# EAGLE design SY88022AL_V2 (EAGLE 9.2.2)
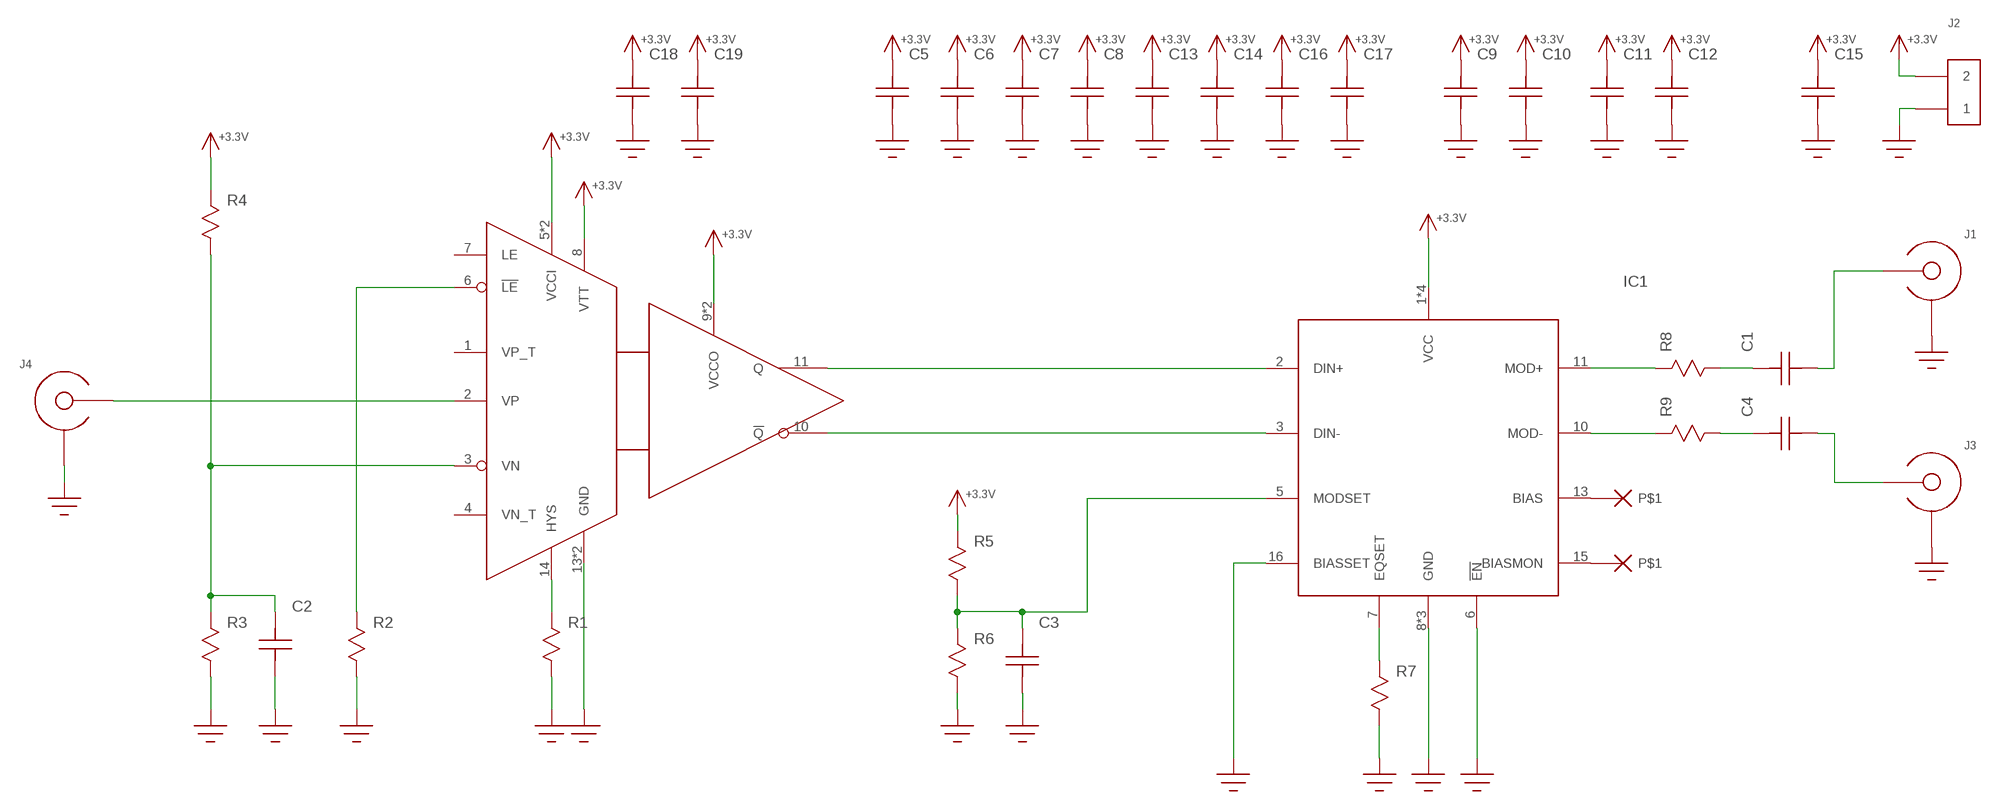
[diagram p0: schematic, sheet 1]

## Parts
C1  C  [C0402]
C2  C0603  [C0603]
C3  C0603  [C0603]
C4  C  [C0402]
C5  C  [C0402]
C6  C  [C0402]
C7  C  [C0402]
C8  C  [C0402]
C9  C0603  [C0603]
C10  C0603  [C0603]
C11  C0603  [C0603]
C12  C0603  [C0603]
C13  C  [C0402]
C14  C  [C0402]
C15  C1206  [1206]
C16  C  [C0402]
C17  C  [C0402]
C18  C0201  [0201]
C19  C0201  [0201]
IC1  SY88022AL  [TQFN16-EP]
J1  SMA_END_LAUNCH4L  [SMA_EDGE_LAUNCH]
J2  HEADER_2PIN  [HEADER_2PIN]
J3  SMA_END_LAUNCH4L  [SMA_EDGE_LAUNCH]
J4  SMA_END_LAUNCH4L  [SMA_EDGE_LAUNCH]
R1  R0603  [R0603]
R2  R0603  [R0603]
R3  R0603  [R0603]
R4  R0603  [R0603]
R5  R0603  [R0603]
R6  R0603  [R0603]
R7  R0603  [R0603]
R8  R0402  [0402]
R9  R0402  [0402]
U$1  ADCMP572  [TQFN16-EP]
U$20  NO_CONNECT  (no package)
U$21  NO_CONNECT  (no package)

## Nets
+3.3V: C5.2 C6.2 C7.2 C8.2 C9.P$2 C10.P$2 C11.P$2 C12.P$2 C13.2 C14.2 C15.P$2 C16.2 C17.2 C18.P$2 C19.P$2 IC1.1(VCC) IC1.4(VCC) IC1.9(VCC) IC1.12(VCC) J2.2 R4.P$1 R5.P$1 U$1.5(VCCI) U$1.8(VTT) U$1.9(VCCO) U$1.12(VCCO) U$1.16(VCCI)
GND: C2.P$1 C3.P$1 C5.1 C6.1 C7.1 C8.1 C9.P$1 C10.P$1 C11.P$1 C12.P$1 C13.1 C14.1 C15.P$1 C16.1 C17.1 C18.P$1 C19.P$1 IC1.6(!EN!) IC1.8(GND) IC1.14(GND) IC1.16(BIASSET) IC1.EP(GND) J1.BOTTOM_PAD(SHIELD) J1.GND@1(SHIELD) J1.GND@2(SHIELD) J1.GND@3(SHIELD) J1.GND@4(SHIELD) J1.GND@5(SHIELD) J1.GND@6(SHIELD) J1.GND@7(SHIELD) J1.GND@8(SHIELD) J1.GND@14(SHIELD) J1.GND@15(SHIELD) J1.GND@16(SHIELD) J1.GND@17(SHIELD) J1.GND_PAD1(SHIELD) J1.GND_PAD2(SHIELD) J2.1 J3.BOTTOM_PAD(SHIELD) J3.GND@1(SHIELD) J3.GND@2(SHIELD) J3.GND@3(SHIELD) J3.GND@4(SHIELD) J3.GND@5(SHIELD) J3.GND@6(SHIELD) J3.GND@7(SHIELD) J3.GND@8(SHIELD) J3.GND@14(SHIELD) J3.GND@15(SHIELD) J3.GND@16(SHIELD) J3.GND@17(SHIELD) J3.GND_PAD1(SHIELD) J3.GND_PAD2(SHIELD) J4.BOTTOM_PAD(SHIELD) J4.GND@1(SHIELD) J4.GND@2(SHIELD) J4.GND@3(SHIELD) J4.GND@4(SHIELD) J4.GND@5(SHIELD) J4.GND@6(SHIELD) J4.GND@7(SHIELD) J4.GND@8(SHIELD) J4.GND@14(SHIELD) J4.GND@15(SHIELD) J4.GND@16(SHIELD) J4.GND@17(SHIELD) J4.GND_PAD1(SHIELD) J4.GND_PAD2(SHIELD) R1.P$2 R2.P$2 R3.P$2 R6.P$2 R7.P$2 U$1.13(GND) U$1.15(GND)
N$1: IC1.2(DIN+) U$1.11(Q)
N$2: IC1.3(DIN-) U$1.10(!Q!)
N$3: R1.P$1 U$1.14(HYS)
N$4: R2.P$1 U$1.6(!LE!)
N$5: C2.P$2 R3.P$1 R4.P$2 U$1.3(VN)
N$6: J4.CENTER@1(CENTER) J4.CENTER@2(CENTER) U$1.2(VP)
N$7: C3.P$2 IC1.5(MODSET) R5.P$2 R6.P$1
N$8: C1.2 R8.2
N$9: IC1.7(EQSET) R7.P$1
N$10: IC1.15(BIASMON) U$20.P$1
N$11: IC1.13(BIAS) U$21.P$1
N$12: IC1.11(MOD+) R8.1
N$13: IC1.10(MOD-) R9.1
N$14: C4.2 R9.2
N$15: C1.1 J1.CENTER@1(CENTER) J1.CENTER@2(CENTER)
N$16: C4.1 J3.CENTER@1(CENTER) J3.CENTER@2(CENTER)
Unconnected: U$1.1(VP_T) U$1.4(VN_T) U$1.7(LE)

## Library data of the parts
C1-C19 = yapo:C
IC1 = yapo:SY88022AL
J1 J3 J4 = yapo:SMA_END_LAUNCH
J2 = yapo:HEADER_2PIN
R1-R9 = yapo:R
U$1 = yapo:ADCMP572
U$20 U$21 = yapo:NO_CONNECT

## Board
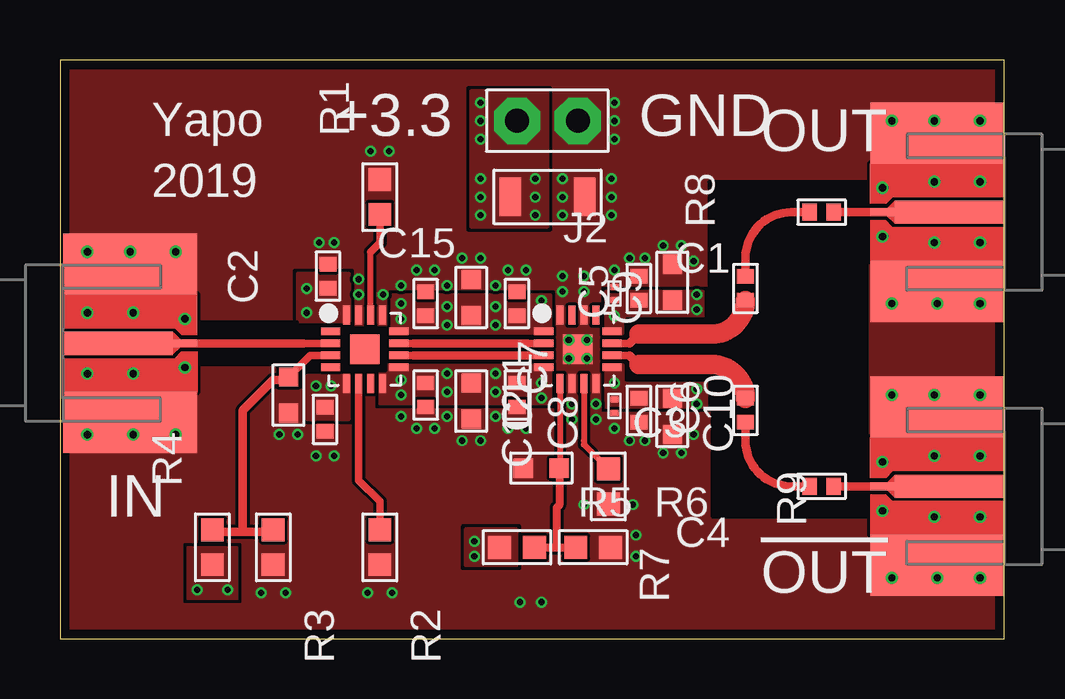
[diagram p1: board, top side]
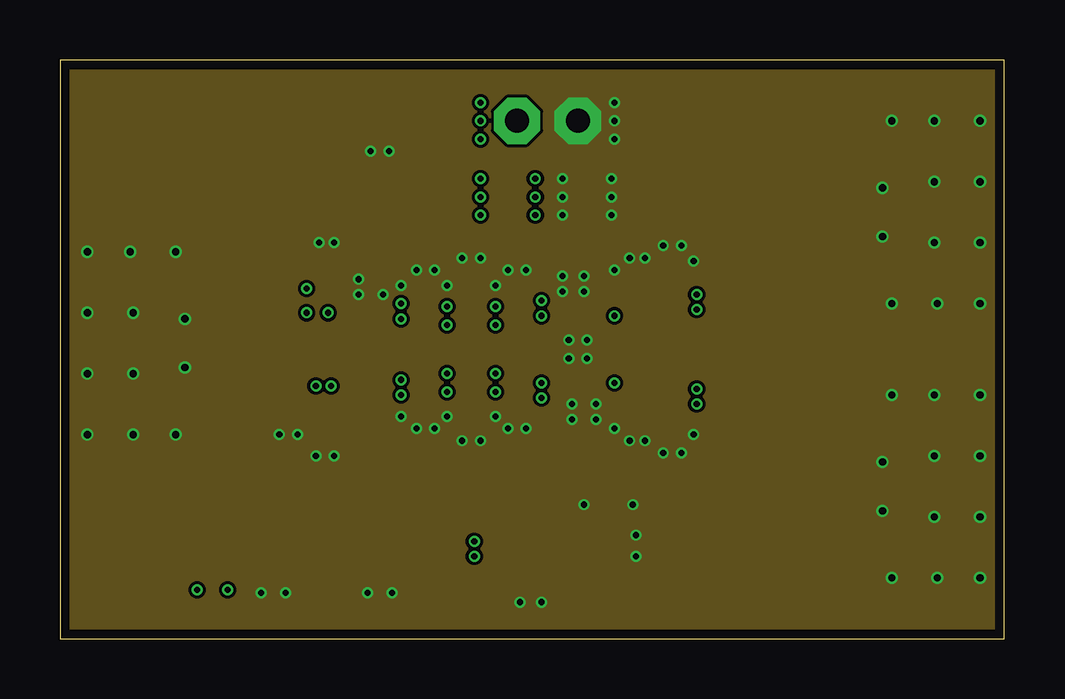
[diagram p2: board, inner layer Route2]
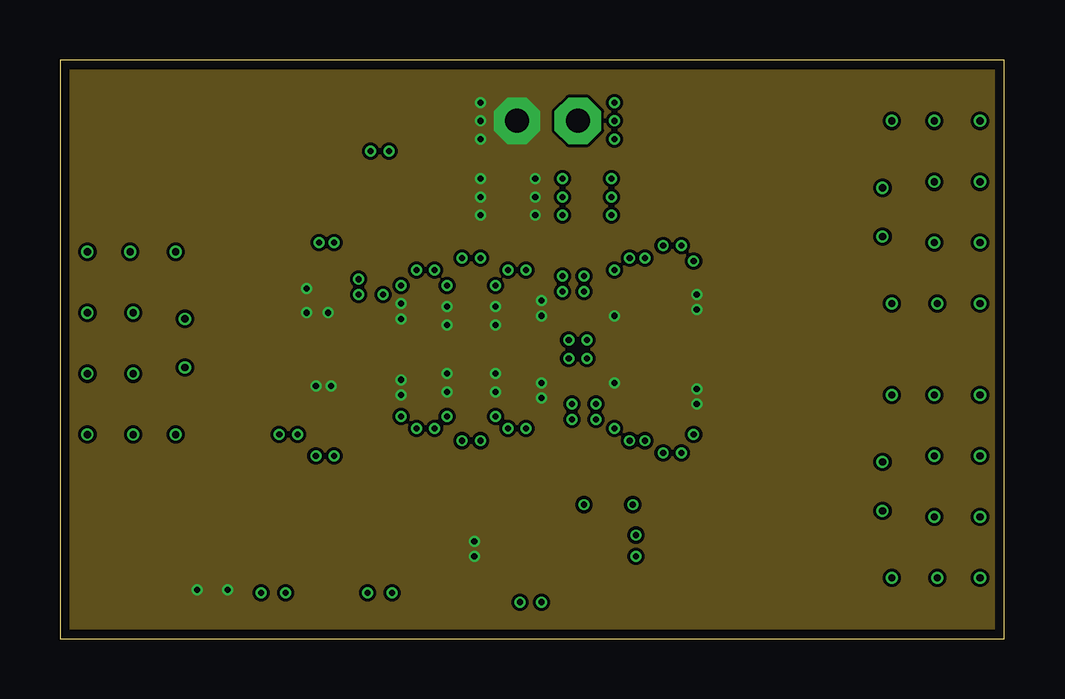
[diagram p3: board, inner layer Route15]
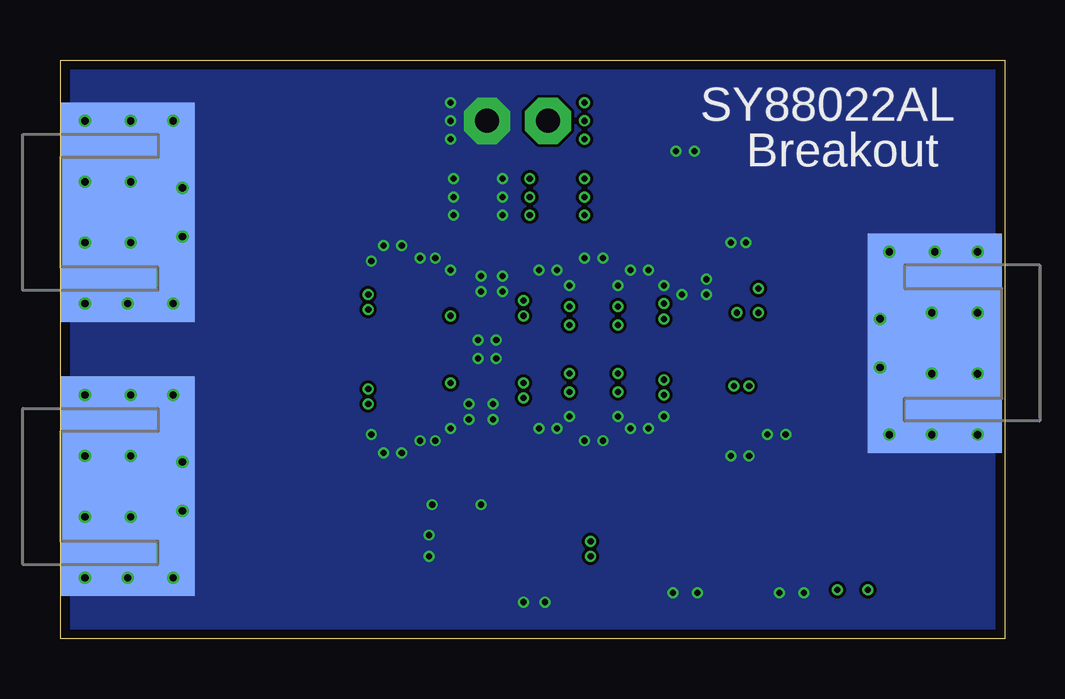
[diagram p4: board, bottom side, seen from below]

Size 39.37 x 24.13 mm. Coordinates in mm from the lower left corner, seen from the top.
Outline: 0,0 39.37,0 39.37,24.13 0,24.13 0,0
Copper layers (1*2*15*16): Top 0.035559375mm / dielectric 0.17018125mm / Route2 0.01778125mm / dielectric 47mil / Route15 0.01778125mm / dielectric 0.17018125mm / Bottom 0.035559375mm
Design rules "oshpark-4layer *": minimum track width 5mil, minimum drill 10mil, track to track 5mil, track to pad 5mil, pad to pad 5mil, via to via 5mil, smd to smd 5mil, copper to edge 15mil, drill to drill 6mil, minimum pad ring 4mil, minimum via ring 4mil, stop-mask expansion 2.5mil, vias tented up to drill 20mil, thermal gap 10mil
tRestrict: area 11.8,11.2 to 13.6,13

### Footprints (pad centres in the part's own frame; a part is rotated, then mirrored left to right if it is on the bottom)
C0402 = smd 0.6 x 0.7: 1 -0.5,0; 2 0.5,0
C0603 = smd 0.8 x 0.8: P$1 -0.75,0; P$2 0.75,0
1206 = smd 0.9 x 1.6: P$1 -1.55,0; P$2 1.55,0
0201 = smd 0.35 x 0.25: P$1 0,0.275; P$2 0,-0.275
TQFN16-EP = smd 0.3 x 0.8: 1 -0.75,-1.425; 2 -0.25,-1.425; 3 0.25,-1.425; 4 0.75,-1.425; 9 0.75,1.425; 10 0.25,1.425; 11 -0.25,1.425; 12 -0.75,1.425 | smd 0.8 x 0.3: 5 1.425,-0.75; 6 1.425,-0.25; 7 1.425,0.25; 8 1.425,0.75; 13 -1.425,0.75; 14 -1.425,0.25; 15 -1.425,-0.25; 16 -1.425,-0.75 | smd 1.23 x 1.23: EP 0,0
SMA_EDGE_LAUNCH = smd 5.588 x 9.144 bottom: BOTTOM_PAD 2.794,0 | smd 4.572 x 0.965: CENTER@1 2.286,0 | smd 1.016 x 0.33: CENTER@2 5.08,0 | drill 0.3: GND@1 1.016,3.81; GND@2 4.699,3.81; GND@3 1.016,1.27; GND@4 5.08,1.016; GND@5 1.016,-1.27; GND@6 5.08,-1.016; GND@7 1.016,-3.81; GND@8 4.699,-3.81; GND@14 2.794,3.81; GND@15 2.921,-3.81; GND@16 2.921,-1.27; GND@17 2.921,1.27 | smd 5.588 x 2.54: GND_PAD1 2.794,3.302; GND_PAD2 2.794,-3.302
HEADER_2PIN = drill 1 pad 1.93 octagon: 1 -1.27,0; 2 1.27,0
R0603 = smd 0.95 x 0.95: P$1 -0.725,0; P$2 0.725,0
0402 = smd 0.6 x 0.7: 1 -0.5,0; 2 0.5,0

### Placement (x,y rotation side)
C1  31.75,17.78 180 top
C2  9.53,10.16 90 top
C3  20.07,7.11 0 top
C4  31.75,6.35 180 top
C5  24.13,9.53 90 top
C6  24.13,14.61 270 top
C7  19.05,10.16 90 top
C8  19.05,13.97 270 top
C9  25.53,9.27 90 top
C10  25.53,14.86 270 top
C11  17.14,9.91 90 top
C12  17.14,14.22 270 top
C13  15.24,13.97 270 top
C14  15.24,10.16 90 top
C15  20.32,18.41 180 top
C16  11.05,9.14 90 top
C17  11.18,15.11 270 top
C18  23.11,14.39 0 top
C19  23.11,9.69 180 top
IC1  21.59,12.06 270 top
J1  39.37,17.78 180 top
J2  20.32,21.59 180 top
J3  39.37,6.35 180 top
J4  0.13,12.32 0 top
R1  13.34,18.41 90 top
R2  13.34,3.81 270 top
R3  8.89,3.81 270 top
R4  6.35,3.81 90 top
R5  19.05,3.81 0 top
R6  22.23,3.81 0 top
R7  22.86,6.35 270 top
R8  28.57,14.61 90 top
R9  28.57,9.53 270 top
U$1  12.7,12.06 270 top

### Tracks (layer width: path | path; a pad name or v marks a point on that pad's centre or on a via)
+3.3V  (via drill 0.25)
  other vias: 23.11,13.46 23.11,10.67 26.54,9.78 26.54,10.41 26.54,14.35 26.54,13.72 20.07,13.46 20.07,14.1 16.13,13.84 16.13,13.08 16.13,11.05 20.07,10.67 20.07,10.03 16.13,10.29 14.22,13.34 14.22,10.79 14.22,13.97 14.22,10.16 18.16,13.84 18.16,13.08 18.16,11.05 18.16,10.29 17.53,19.18 17.53,18.41 17.53,17.65 17.53,22.35 17.53,21.59 17.53,20.83 19.81,19.18 19.81,18.41 19.81,17.65 11.18,13.59 10.29,14.61 10.29,13.59 5.71,2.03 6.99,2.03 10.67,10.54 11.3,10.54 17.27,4.06 17.27,3.43
  pour Top (no thermals): 22.73,14.48 22.73,12.73 23.47,12.73 23.47,13.4 26.82,13.4 26.82,14.48
  pour Top (no thermals): 22.73,11.4 22.73,9.65 26.97,9.65 26.97,10.67 23.5,10.67 23.5,11.4
  pour Top (no thermals): 20.45,12.73 13.84,12.73 13.84,14.35 20.45,14.35
  pour Top (no thermals): 20.45,9.78 13.34,9.78 13.34,11.4 20.45,11.4
  pour Route15 (no thermals): 0,0 39.37,0 39.37,24.13 0,24.13
  pour Top (no thermals): 20.32,22.86 20.32,17.14 17.14,17.14 17.14,22.86
  pour Top (no thermals): 9.91,15.24 12.06,15.24 12.06,13.21 9.91,13.21
  pour Top (no thermals): 5.33,3.81 7.37,3.81 7.37,1.65 5.33,1.65
  pour Top (no thermals): 10.29,9.14 12.06,9.14 12.06,10.97 10.29,10.97
  pour Top (no thermals): 16.89,4.57 16.89,3.05 19.05,3.05 19.05,4.57
GND  (via drill 0.25)
  other vias: 10.79,16.51 11.43,16.51 9.14,8.51 9.91,8.51 10.67,7.62 11.43,7.62 8.38,1.91 9.4,1.91 12.83,1.91 13.84,1.91 19.18,1.52 20.07,1.52 24,4.32 24,3.43 23.88,5.59 21.84,5.59 25.15,7.75 25.91,7.75 23.75,8.26 17.53,8.26 18.16,9.27 16.76,8.26 14.22,9.27 16.13,9.27 19.43,8.76 16.76,15.88 17.53,15.88 18.67,15.37 19.43,15.37 14.22,14.73 14.86,15.37 21.84,14.48 23.11,15.37 23.75,15.88 25.15,16.38 25.91,16.38 26.42,15.75 26.42,8.51 23.11,8.76 18.67,8.76 14.86,8.76 15.62,8.76 15.62,15.37 16.13,14.73 18.16,14.73 22.35,9.78 21.34,9.78 21.34,9.14 22.35,9.14 21.21,12.45 21.97,12.45 21.21,11.68 21.97,11.68 24.38,15.88 24.38,8.26 22.99,19.18 22.99,18.41 22.99,17.65 23.11,22.35 23.11,21.59 23.11,20.83 20.95,19.18 20.95,18.41 20.95,17.65 13.46,14.35 12.45,14.35 20.95,14.48 20.95,15.11 21.84,15.11 12.45,14.99 12.95,20.32 13.72,20.32
  pour Top (rank 2, no thermals): 0,0 39.37,0 39.37,24.13 0,24.13
  pour Route2 (no thermals): 0,0 39.37,0 39.37,24.13 0,24.13
  pour Bottom (no thermals): 0,0 39.37,0 39.37,24.13 0,24.13
  cutout Top: 5.71,13.21 5.71,11.43 9.91,11.43 9.91,13.21
  cutout Top: 33.66,19.05 27.05,19.05 27.05,13.34 23.62,13.34 23.62,10.79 27.18,10.79 27.18,5.08 33.66,5.08
N$1
  Top 0.305: U$1.11 14.73,12.31 | IC1.2 19.49,12.31
  Top 0.356: 14.73,12.31 19.49,12.31
N$2
  Top 0.305: U$1.10 14.73,11.81 | 19.49,11.81 IC1.3
  Top 0.356: 14.73,11.81 19.49,11.81
N$3
  Top 0.254: U$1.14 12.95,16.12
  Top 0.305: 12.95,16.12 13.34,16.51 R1.P$1
N$4
  Top 0.305: U$1.6 12.45,6.6 13.34,5.71 R2.P$1
N$5
  Top 0.305: U$1.3 10.43,11.81 C2.P$2
  Top 0.356: C2.P$2 9.41,10.79 8.89,10.79 7.62,9.53 7.62,4.45 | 7.62,4.45 8.8,4.45 R3.P$1 | 7.62,4.45 6.44,4.45 R4.P$2
N$6
  Top 0.305: U$1.2 10.16,12.31
  Top 0.33: J4.CENTER@2 3.17,12.31 J4.CENTER@1
  Top 0.356: 10.16,12.31 3.17,12.31 2.88,12.31
N$7
  Top 0.254: IC1.5 20.84,7.14 C3.P$2
  Top 0.33: R5.P$2 20.7,3.81 | 20.7,3.81 R6.P$1 | C3.P$2 20.82,5.58 20.7,5.46 20.7,3.81
N$8
  Top 0.356: C1.2 30.48,17.78 arc90 28.57,15.88 R8.2
N$9
  Top 0.254: IC1.7 21.84,8.26 21.84,8.1 R7.P$1
N$12
  Top 0.305: IC1.11 23.75,12.31
  Top 0.356: 23.75,12.31 24.13,12.7
  Top 0.813: 24.13,12.7 27.17,12.7 arc90 R8.1
N$13
  Top 0.305: IC1.10 23.75,11.81
  Top 0.356: 23.75,11.81 24.13,11.43
  Top 0.813: 24.13,11.43 27.17,11.43 arc-90 R9.1
N$14
  Top 0.356: C4.2 30.48,6.35 arc-90 28.57,8.26 R9.2
N$15
  Top 0.33: J1.CENTER@1 J1.CENTER@2
  Top 0.356: J1.CENTER@2 C1.1
N$16
  Top 0.33: J3.CENTER@1 J3.CENTER@2
  Top 0.356: J3.CENTER@2 C4.1

### Text on the board
tPlace: Yapo | +3.3 | GND | OUT | 2019 | IN | !OUT!
bPlace: SY88022AL | Breakout